# Altium schematic sheet 2017_IHM.SchDoc
size A2
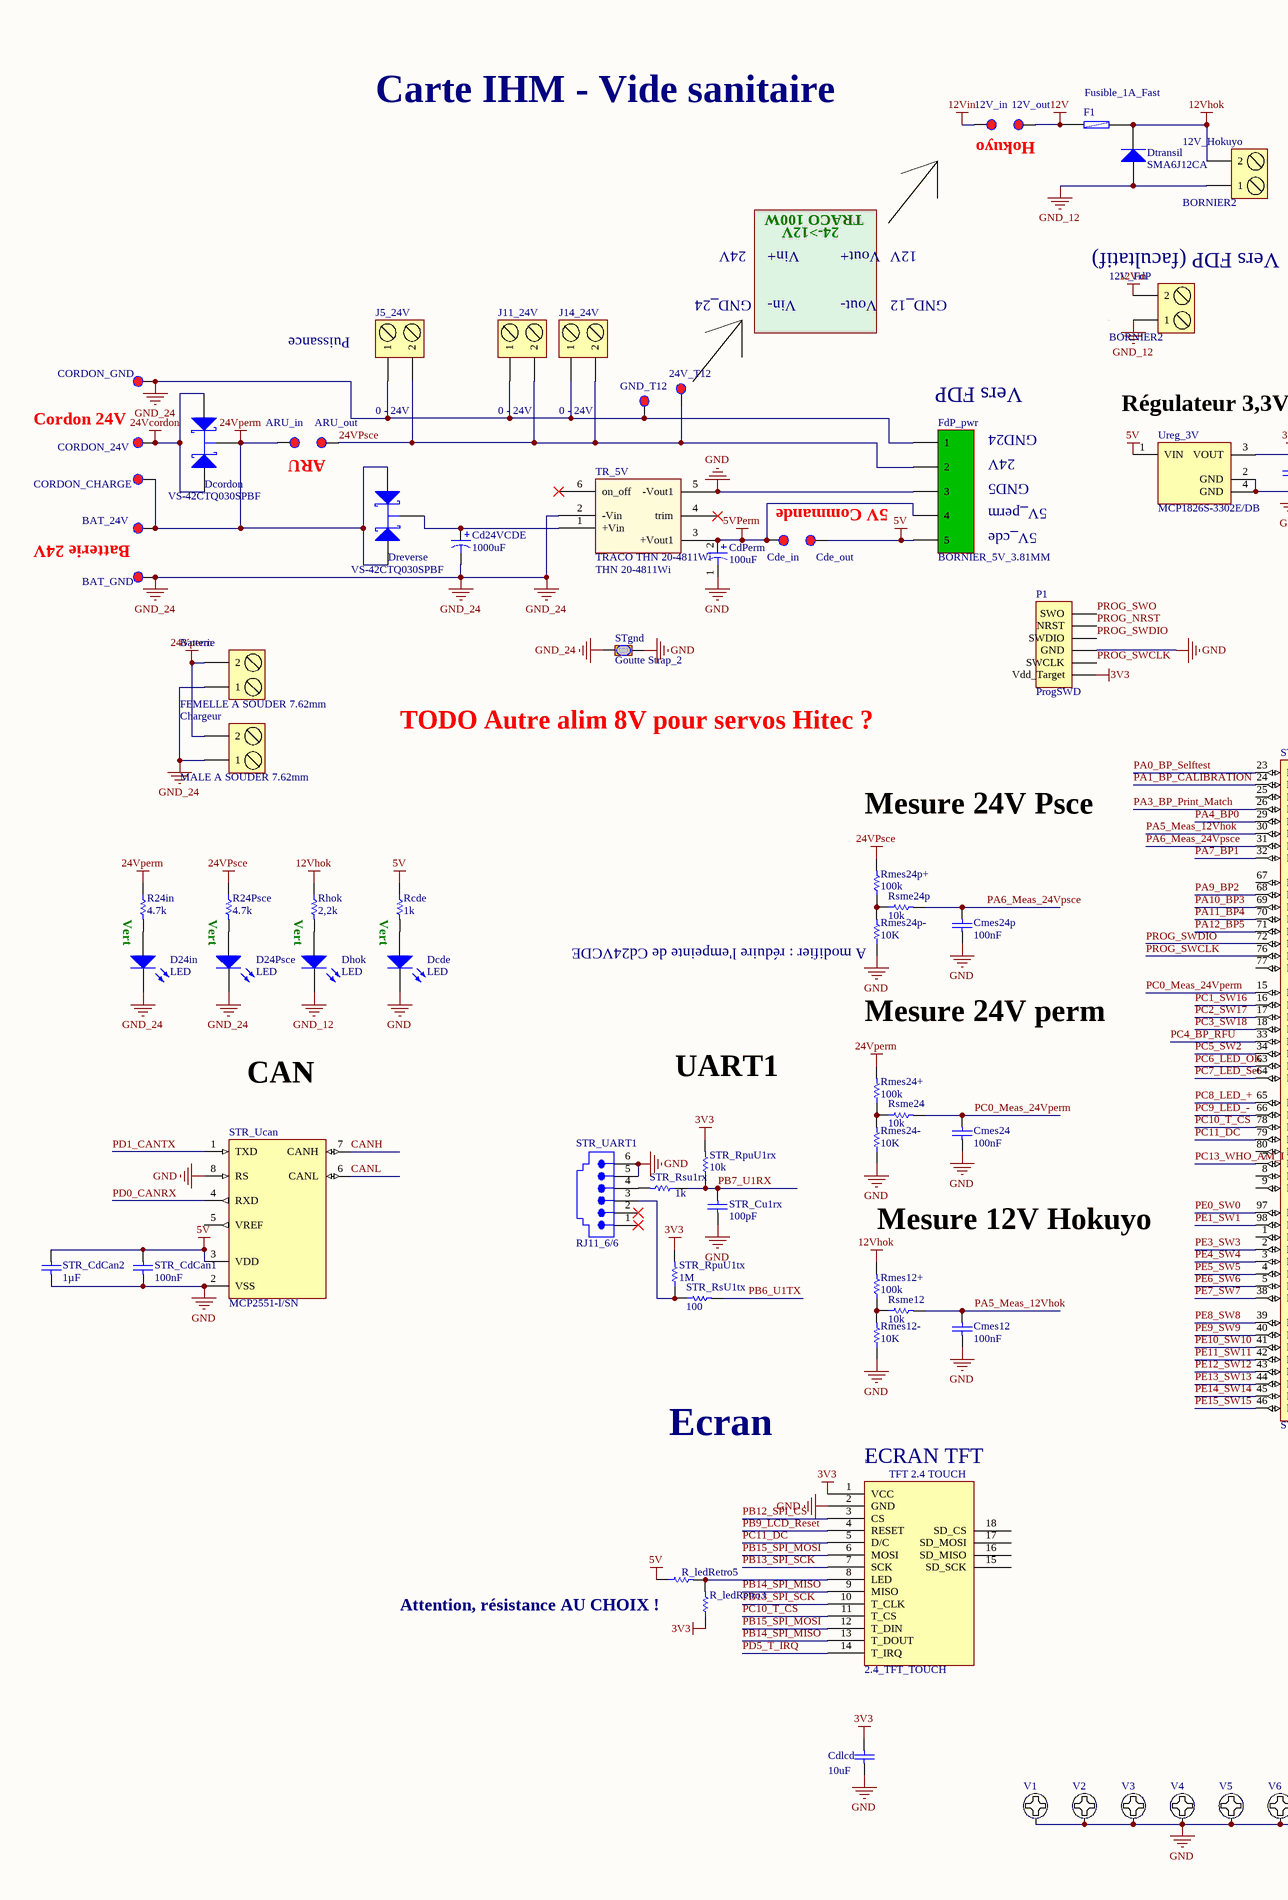
[diagram p0: 2017_IHM.SchDoc, left]
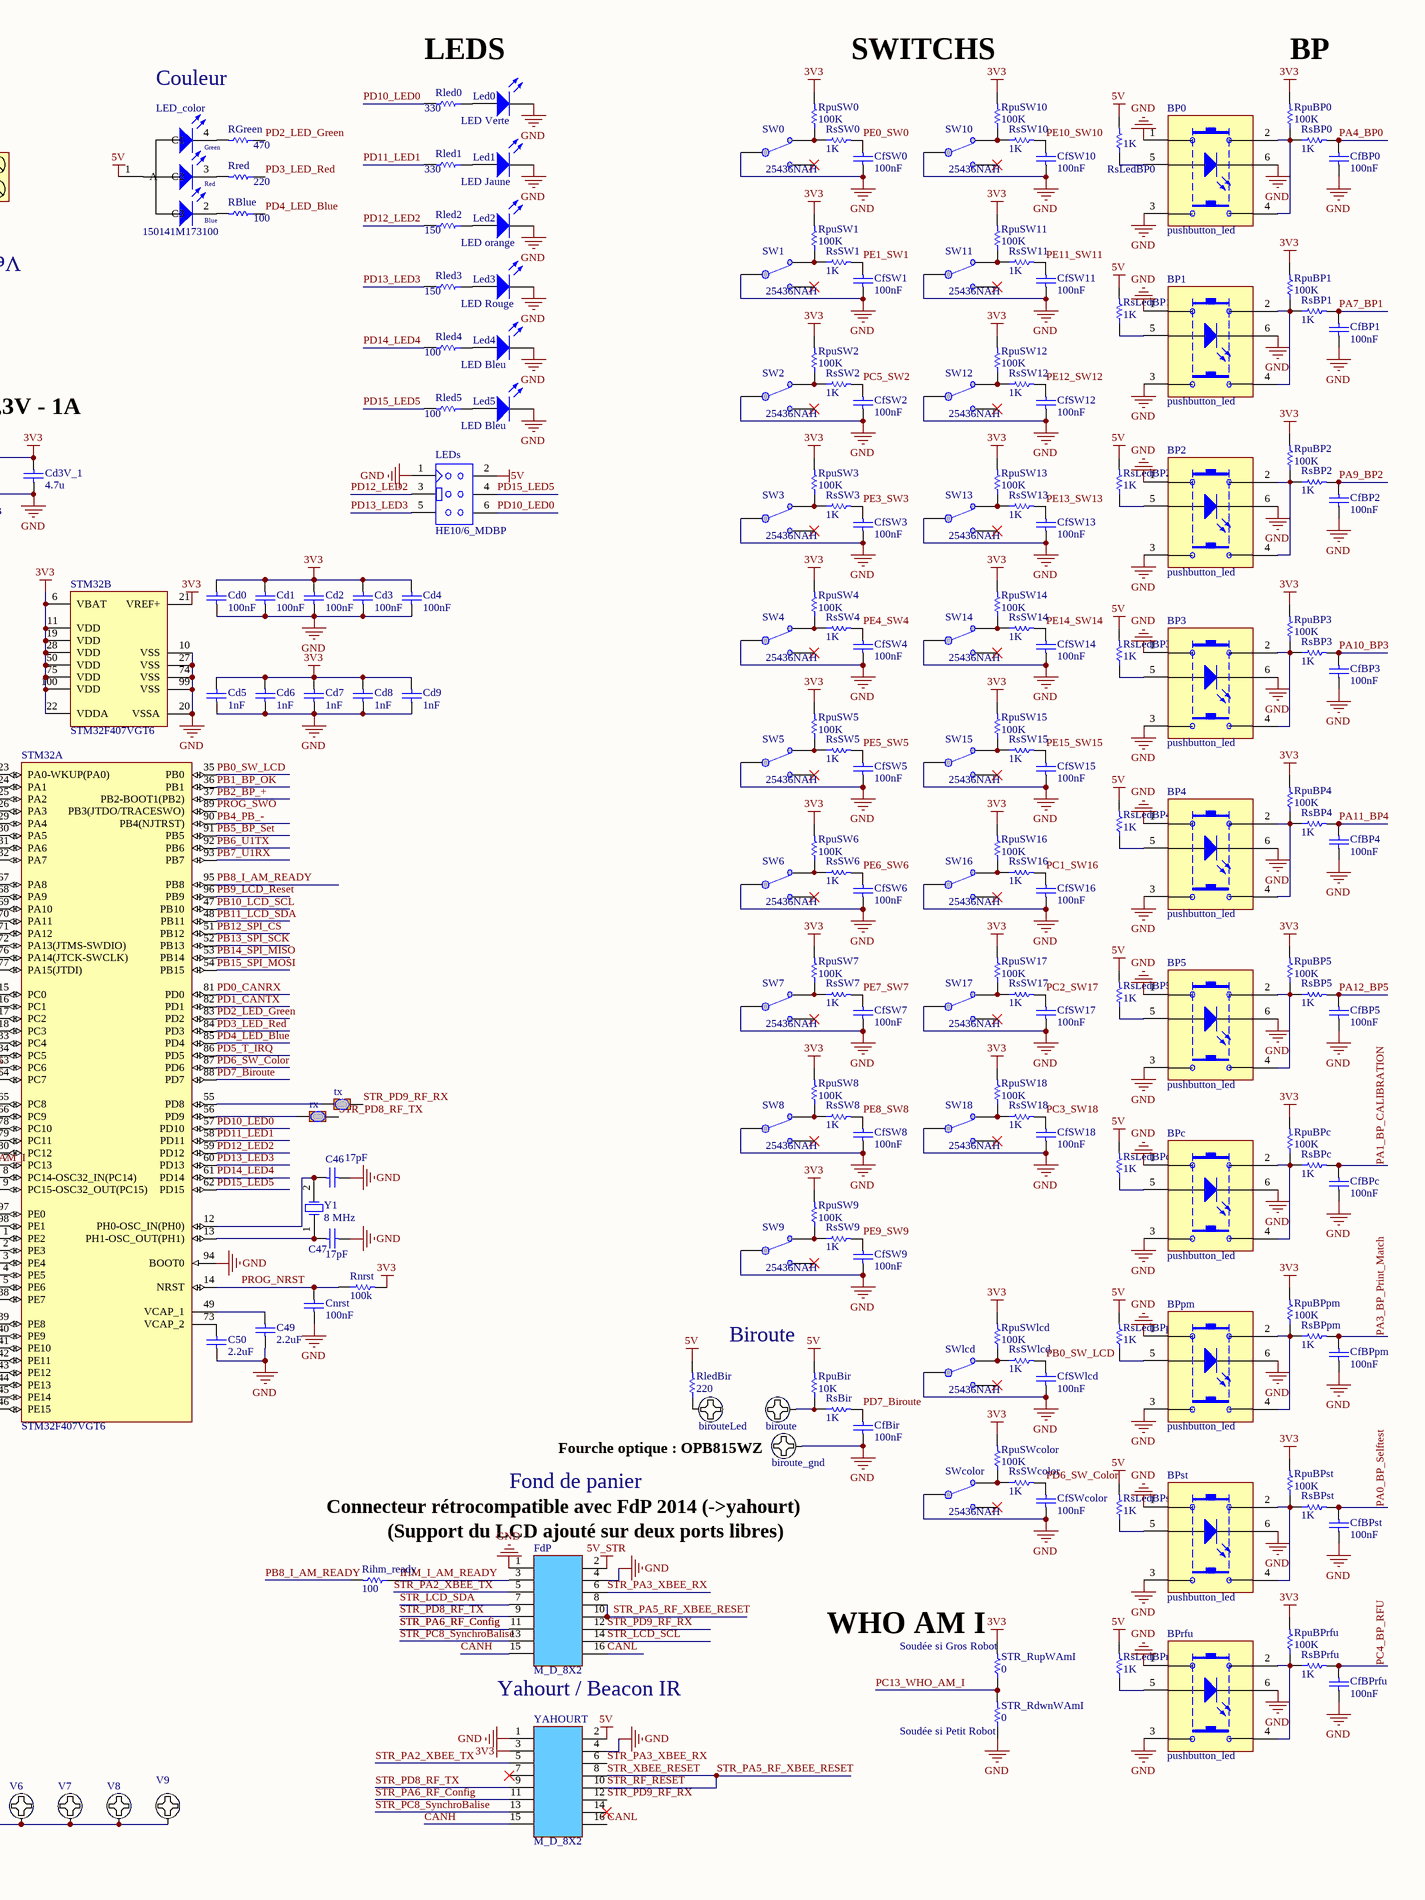
[diagram p1: 2017_IHM.SchDoc, right]

## Parts
12V_FdP  BORNIER2  [BORNIER2]
12V_Hokuyo  BORNIER2  [BORNIER2_HORIZ]
12V_in  Name  [Point Test_D3_P1.6mm]  (value not drawn)
12V_out  Name  [Point Test_D3_P1.6mm]  (value not drawn)
24V_T12  Name  [Point Test_D3_P1.6mm]  (value not drawn)
*  2.4_TFT_TOUCH  [2.4_TFT_TOUCH]
ARU_in  Name  [Point Test_D3_P1.6mm]  (value not drawn)
ARU_out  Name  [Point Test_D3_P1.6mm]  (value not drawn)
BAT_24V  Name  [Point Test_D3_P1.6mm]  (value not drawn)
BAT_GND  Name  [Point Test_D3_P1.6mm]  (value not drawn)
Batterie  FEMELLE A SOUDER 7.62mm  [BORNIER2_FEM_COUDE]
biroute  Pad_M3  [PAD_CMS_5.08x2.54]  (value not drawn)
biroute_gnd  Pad_M3  [PAD_CMS_5.08x2.54]  (value not drawn)
birouteLed  Pad_M3  [PAD_CMS_5.08x2.54]  (value not drawn)
BP0  pushbutton_led  [PUSHBUTTON_LED]
BP1  pushbutton_led  [PUSHBUTTON_LED]
BP2  pushbutton_led  [PUSHBUTTON_LED]
BP3  pushbutton_led  [PUSHBUTTON_LED]
BP4  pushbutton_led  [PUSHBUTTON_LED]
BP5  pushbutton_led  [PUSHBUTTON_LED]
BPc  pushbutton_led  [PUSHBUTTON_LED]
BPpm  pushbutton_led  [PUSHBUTTON_LED]
BPrfu  pushbutton_led  [PUSHBUTTON_LED]
BPst  pushbutton_led  [PUSHBUTTON_LED]
C46  17pF  [C0805_N]
C47  17pF  [C0805_N]
C49  2.2uF  [C0805_N]
C50  2.2uF  [C0805_N]
Cd0  100nF  [C0805_N]
Cd1  100nF  [C0805_N]
Cd2  100nF  [C0805_N]
Cd3  100nF  [C0805_N]
Cd3V_1  4.7u  [C0805_N]
Cd4  100nF  [C0805_N]
Cd5  1nF  [C0805_N]
Cd6  1nF  [C0805_N]
Cd7  1nF  [C0805_N]
Cd8  1nF  [C0805_N]
Cd9  1nF  [C0805_N]
Cd24VCDE  1000uF  [RESISTANCE_5W]
Cde_in  Name  [Point Test_D3_P1.6mm]  (value not drawn)
Cde_out  Name  [Point Test_D3_P1.6mm]  (value not drawn)
Cdlcd  10uF  [C0805_N]
CdPerm  100uF  [CONDENSATEUR_POLARISE_ELECTROLYTIQUE_RADIAL_5.08/8.9]
CfBir  100nF  [C0805_N]
CfBP0  100nF  [C0805_N]
CfBP1  100nF  [C0805_N]
CfBP2  100nF  [C0805_N]
CfBP3  100nF  [C0805_N]
CfBP4  100nF  [C0805_N]
CfBP5  100nF  [C0805_N]
CfBPc  100nF  [C0805_N]
CfBPpm  100nF  [C0805_N]
CfBPrfu  100nF  [C0805_N]
CfBPst  100nF  [C0805_N]
CfSW0  100nF  [C0805_N]
CfSW1  100nF  [C0805_N]
CfSW2  100nF  [C0805_N]
CfSW3  100nF  [C0805_N]
CfSW4  100nF  [C0805_N]
CfSW5  100nF  [C0805_N]
CfSW6  100nF  [C0805_N]
CfSW7  100nF  [C0805_N]
CfSW8  100nF  [C0805_N]
CfSW9  100nF  [C0805_N]
CfSW10  100nF  [C0805_N]
CfSW11  100nF  [C0805_N]
CfSW12  100nF  [C0805_N]
CfSW13  100nF  [C0805_N]
CfSW14  100nF  [C0805_N]
CfSW15  100nF  [C0805_N]
CfSW16  100nF  [C0805_N]
CfSW17  100nF  [C0805_N]
CfSW18  100nF  [C0805_N]
CfSWcolor  100nF  [C0805_N]
CfSWlcd  100nF  [C0805_N]
Chargeur  MALE A SOUDER 7.62mm  [BORNIER2_FEM_COUDE]
Cmes12  100nF  [C0805_N]
Cmes24  100nF  [C0805_N]
Cmes24p  100nF  [C0805_N]
Cnrst  100nF  [C0805_N]
CORDON_24V  Name  [Point Test_D3_P1.6mm]  (value not drawn)
CORDON_CHARGE  Name  [Point Test_D3_P1.6mm]  (value not drawn)
CORDON_GND  Name  [Point Test_D3_P1.6mm]  (value not drawn)
D24in  LED  [LED_0805]
D24Psce  LED  [LED_0805]
Dcde  LED  [LED_0805]
Dcordon  VS-42CTQ030SPBF  [D2Pak (123)]
Dhok  LED  [LED_0805]
Dreverse  VS-42CTQ030SPBF  [D2Pak (123)]
Dtransil  SMA6J12CA  [DO214AC]
F1  Fusible_1A_Fast  [R0805_N]
FdP  Type: M_D_8X2  [HE10/16_M_D_B P]  (hidden comment: BARRETTE_8 CONTACTS_2 RANGEES_MALE_DROITE)
FdP_pwr  BORNIER_5V_3.81MM  [BORNIER_5V_3.5MM_femelle_0]
GND_T12  Name  [Point Test_D3_P1.6mm]  (value not drawn)
J5_24V  0 - 24V  [BORNIER2_FEM_COUDE]
J11_24V  0 - 24V  [BORNIER2_FEM_COUDE]
J14_24V  0 - 24V  [BORNIER2_FEM_COUDE]
Led0  LED Verte  [LED_0805]
Led1  LED Jaune  [LED_0805]
Led2  LED orange  [LED_0805]
Led3  LED Rouge  [LED_0805]
Led4  LED Bleu  [LED_0805]
Led5  LED Bleu  [LED_0805]
LED_color  150141M173100  [3528]
LEDs  Type: HE10/6_MDBP  [HE10/6_M_D_BP]  (hidden comment: HE10/6_MALE_DROIT_BAS PROFIL)
P1  ProgSWD  [HDR1X6]
R24in  4.7k  [R1206_N]
R24Psce  4.7k  [R1206_N]
R_ledRetro3  (no value)  [R1206_N]
R_ledRetro5  (no value)  [R1206_N]
RBlue  100  [R1206_N]
Rcde  1k  [R1206_N]
RGreen  470  [R1206_N]
Rhok  2,2k  [R1206_N]
Rihm_ready  100  [R1206_N]
Rled0  330  [R1206_N]
Rled1  330  [R1206_N]
Rled2  150  [R1206_N]
Rled3  150  [R1206_N]
Rled4  100  [R1206_N]
Rled5  100  [R1206_N]
RledBir  220  [R1206_N]
Rmes12+  100k  [R1206_N]
Rmes12-  10K  [R1206_N]
Rmes24+  100k  [R1206_N]
Rmes24-  10K  [R1206_N]
Rmes24p+  100k  [R1206_N]
Rmes24p-  10K  [R1206_N]
Rnrst  100k  [R1206_N]
RpuBir  10K  [R1206_N]
RpuBP0  100K  [R1206_N]
RpuBP1  100K  [R1206_N]
RpuBP2  100K  [R1206_N]
RpuBP3  100K  [R1206_N]
RpuBP4  100K  [R1206_N]
RpuBP5  100K  [R1206_N]
RpuBPc  100K  [R1206_N]
RpuBPpm  100K  [R1206_N]
RpuBPrfu  100K  [R1206_N]
RpuBPst  100K  [R1206_N]
RpuSW0  100K  [R1206_N]
RpuSW1  100K  [R1206_N]
RpuSW2  100K  [R1206_N]
RpuSW3  100K  [R1206_N]
RpuSW4  100K  [R1206_N]
RpuSW5  100K  [R1206_N]
RpuSW6  100K  [R1206_N]
RpuSW7  100K  [R1206_N]
RpuSW8  100K  [R1206_N]
RpuSW9  100K  [R1206_N]
RpuSW10  100K  [R1206_N]
RpuSW11  100K  [R1206_N]
RpuSW12  100K  [R1206_N]
RpuSW13  100K  [R1206_N]
RpuSW14  100K  [R1206_N]
RpuSW15  100K  [R1206_N]
RpuSW16  100K  [R1206_N]
RpuSW17  100K  [R1206_N]
RpuSW18  100K  [R1206_N]
RpuSWcolor  100K  [R1206_N]
RpuSWlcd  100K  [R1206_N]
Rred  220  [R1206_N]
RsBir  1K  [R1206_N]
RsBP0  1K  [R1206_N]
RsBP1  1K  [R1206_N]
RsBP2  1K  [R1206_N]
RsBP3  1K  [R1206_N]
RsBP4  1K  [R1206_N]
RsBP5  1K  [R1206_N]
RsBPc  1K  [R1206_N]
RsBPpm  1K  [R1206_N]
RsBPrfu  1K  [R1206_N]
RsBPst  1K  [R1206_N]
RsLedBP0  1K  [R1206_N]
RsLedBP1  1K  [R1206_N]
RsLedBP2  1K  [R1206_N]
RsLedBP3  1K  [R1206_N]
RsLedBP4  1K  [R1206_N]
RsLedBP5  1K  [R1206_N]
RsLedBPc  1K  [R1206_N]
RsLedBPpm  1K  [R1206_N]
RsLedBPrfu  1K  [R1206_N]
RsLedBPst  1K  [R1206_N]
Rsme12  10k  [R1206_N]
Rsme24  10k  [R1206_N]
Rsme24p  10k  [R1206_N]
RsSW0  1K  [R1206_N]
RsSW1  1K  [R1206_N]
RsSW2  1K  [R1206_N]
RsSW3  1K  [R1206_N]
RsSW4  1K  [R1206_N]
RsSW5  1K  [R1206_N]
RsSW6  1K  [R1206_N]
RsSW7  1K  [R1206_N]
RsSW8  1K  [R1206_N]
RsSW9  1K  [R1206_N]
RsSW10  1K  [R1206_N]
RsSW11  1K  [R1206_N]
RsSW12  1K  [R1206_N]
RsSW13  1K  [R1206_N]
RsSW14  1K  [R1206_N]
RsSW15  1K  [R1206_N]
RsSW16  1K  [R1206_N]
RsSW17  1K  [R1206_N]
RsSW18  1K  [R1206_N]
RsSWcolor  1K  [R1206_N]
RsSWlcd  1K  [R1206_N]
rx  Goutte Strap_2  [Goutte Strap_2 Pads_Clearance 0.254mm]  (value not drawn)
STgnd  Goutte Strap_2  [Goutte Strap_2 Pads_Clearance 0.254mm]
STM32  STM32F407VGT6  [STM-LQFP100_N]  (parts A,B of 2)
STR_CdCan1  100nF  [C0805_N]
STR_CdCan2  1µF  [C0805_N]
STR_Cu1rx  100pF  [C0805_N]
STR_RdwnWAmI  0  [R1206_N]
STR_RpuU1rx  10k  [R1206_N]
STR_RpuU1tx  1M  [R1206_N]
STR_Rsu1rx  1k  [R1206_N]
STR_RsU1tx  100  [R1206_N]
STR_RupWAmI  0  [R1206_N]
STR_UART1  RJ11_6/6  [RJ11_6/6 - Wurth Half Shielded Tab Down WR-MJ]
STR_Ucan  MCP2551-I/SN  [SO8_N]
SW0  25436NAH  [SW_UNIPOL_DROIT - Ebay - SPDT - 11x6x5]
SW1  25436NAH  [SW_UNIPOL_DROIT - Ebay - SPDT - 11x6x5]
SW2  25436NAH  [SW_UNIPOL_DROIT - Ebay - SPDT - 11x6x5]
SW3  25436NAH  [SW_UNIPOL_DROIT - Ebay - SPDT - 11x6x5]
SW4  25436NAH  [SW_UNIPOL_DROIT - Ebay - SPDT - 11x6x5]
SW5  25436NAH  [SW_UNIPOL_DROIT - Ebay - SPDT - 11x6x5]
SW6  25436NAH  [SW_UNIPOL_DROIT - Ebay - SPDT - 11x6x5]
SW7  25436NAH  [SW_UNIPOL_DROIT - Ebay - SPDT - 11x6x5]
SW8  25436NAH  [SW_UNIPOL_DROIT - Ebay - SPDT - 11x6x5]
SW9  25436NAH  [SW_UNIPOL_DROIT - Ebay - SPDT - 11x6x5]
SW10  25436NAH  [SW_UNIPOL_DROIT - Ebay - SPDT - 11x6x5]
SW11  25436NAH  [SW_UNIPOL_DROIT - Ebay - SPDT - 11x6x5]
SW12  25436NAH  [SW_UNIPOL_DROIT - Ebay - SPDT - 11x6x5]
SW13  25436NAH  [SW_UNIPOL_DROIT - Ebay - SPDT - 11x6x5]
SW14  25436NAH  [SW_UNIPOL_DROIT - Ebay - SPDT - 11x6x5]
SW15  25436NAH  [SW_UNIPOL_DROIT - Ebay - SPDT - 11x6x5]
SW16  25436NAH  [SW_UNIPOL_DROIT - Ebay - SPDT - 11x6x5]
SW17  25436NAH  [SW_UNIPOL_DROIT - Ebay - SPDT - 11x6x5]
SW18  25436NAH  [SW_UNIPOL_DROIT - Ebay - SPDT - 11x6x5]
SWcolor  25436NAH  [SW_UNIPOL_DROIT - APEM 18235]
SWlcd  25436NAH  [SW_UNIPOL_DROIT - Ebay - SPDT - 11x6x5]
TR_5V  TRACO THN 20-4811Wi  Ref: THN 20-4811Wi  [TRACO_THN20]
tx  Goutte Strap_2  [Goutte Strap_2 Pads_Clearance 0.254mm]  (value not drawn)
Ureg_3V  MCP1826S-3302E/DB  [SOT223-4N]
V1  Pad_M3  [M3x6mm]  (value not drawn)
V2  Pad_M3  [M3x6mm]  (value not drawn)
V3  Pad_M3  [M3x6mm]  (value not drawn)
V4  Pad_M3  [M3x6mm]  (value not drawn)
V5  Pad_M3  [M3x6mm]  (value not drawn)
V6  Pad_M3  [M3x6mm]  (value not drawn)
V7  Pad_M3  [M3x6mm]  (value not drawn)
V8  Pad_M3  [M3x6mm]  (value not drawn)
V9  Pad_M3  [M3x6mm]  (value not drawn)
Y1  8 MHz  [HC49/4H_SMX]
YAHOURT  Type: M_D_8X2  [HE10/16_M_D_B P]  (hidden comment: BARRETTE_8 CONTACTS_2 RANGEES_MALE_DROITE)

## Nets
3V3: *.1(VCC) Cd0.2 Cd1.2 Cd2.2 Cd3.2 Cd3V_1.2 Cd4.2 Cd5.2 Cd6.2 Cd7.2 Cd8.2 Cd9.2 Cdlcd.1 P1.1(Vdd_Target) R_ledRetro3.1 Rnrst.2 RpuBP0.2 RpuBP1.2 RpuBP2.2 RpuBP3.2 RpuBP4.2 RpuBP5.2 RpuBPc.2 RpuBPpm.2 RpuBPrfu.2 RpuBPst.2 RpuSW0.2 RpuSW1.2 RpuSW2.2 RpuSW3.2 RpuSW4.2 RpuSW5.2 RpuSW6.2 RpuSW7.2 RpuSW8.2 RpuSW9.2 RpuSW10.2 RpuSW11.2 RpuSW12.2 RpuSW13.2 RpuSW14.2 RpuSW15.2 RpuSW16.2 RpuSW17.2 RpuSW18.2 RpuSWcolor.2 RpuSWlcd.2 STM32.6(VBAT) STM32.11(VDD) STM32.19(VDD) STM32.21(VREF+) STM32.22(VDDA) STM32.28(VDD) STM32.50(VDD) STM32.75(VDD) STM32.100(VDD) STR_RpuU1rx.2 STR_RpuU1tx.2 STR_RupWAmI.2 Ureg_3V.3(VOUT) YAHOURT.3
5V: Cde_out.1 FdP_pwr.5 LED_color.1(A) LEDs.2 R_ledRetro5.1 Rcde.1 RledBir.2 RpuBir.2 RsLedBP0.2 RsLedBP1.2 RsLedBP2.2 RsLedBP3.2 RsLedBP4.2 RsLedBP5.2 RsLedBPc.2 RsLedBPpm.2 RsLedBPrfu.2 RsLedBPst.2 STR_CdCan1.2 STR_CdCan2.2 STR_Ucan.3(VDD) Ureg_3V.1(VIN) YAHOURT.2
5V_STR: FdP.2
5VPerm: Cde_in.1 CdPerm.2 FdP_pwr.4 TR_5V.3(+Vout1)
12V: 12V_out.1 F1.1
12Vhok: 12V_Hokuyo.2 Dtransil.2(K) F1.2 Rhok.1 Rmes12+.2
12Vin: 12V_FdP.2 12V_in.1
24Vcordon: CORDON_24V.1 Dcordon.1(A1) Dcordon.3(A2)
24Vperm: ARU_in.1 BAT_24V.1 Batterie.2 Chargeur.2 CORDON_CHARGE.1 Dcordon.2(K) Dreverse.1(A1) Dreverse.3(A2) R24in.1 Rmes24+.2
24VPsce: 24V_T12.1 ARU_out.1 FdP_pwr.2 J5_24V.2 J11_24V.2 J14_24V.2 R24Psce.1 Rmes24p+.2
GND: *.2(GND) biroute_gnd.1 BP0.1 BP0.3 BP0.6(-) BP1.1 BP1.3 BP1.6(-) BP2.1 BP2.3 BP2.6(-) BP3.1 BP3.3 BP3.6(-) BP4.1 BP4.3 BP4.6(-) BP5.1 BP5.3 BP5.6(-) BPc.1 BPc.3 BPc.6(-) BPpm.1 BPpm.3 BPpm.6(-) BPrfu.1 BPrfu.3 BPrfu.6(-) BPst.1 BPst.3 BPst.6(-) C46.1 C47.1 C49.1 C50.1 Cd0.1 Cd1.1 Cd2.1 Cd3.1 Cd3V_1.1 Cd4.1 Cd5.1 Cd6.1 Cd7.1 Cd8.1 Cd9.1 Cdlcd.2 CdPerm.1 CfBir.1 CfBP0.1 CfBP1.1 CfBP2.1 CfBP3.1 CfBP4.1 CfBP5.1 CfBPc.1 CfBPpm.1 CfBPrfu.1 CfBPst.1 CfSW0.1 CfSW1.1 CfSW2.1 CfSW3.1 CfSW4.1 CfSW5.1 CfSW6.1 CfSW7.1 CfSW8.1 CfSW9.1 CfSW10.1 CfSW11.1 CfSW12.1 CfSW13.1 CfSW14.1 CfSW15.1 CfSW16.1 CfSW17.1 CfSW18.1 CfSWcolor.1 CfSWlcd.1 Cmes12.1 Cmes24.1 Cmes24p.1 Cnrst.1 Dcde.2(K) FdP.1 FdP.4 FdP_pwr.3 Led0.2(K) Led1.2(K) Led2.2(K) Led3.2(K) Led4.2(K) Led5.2(K) LEDs.1 P1.3(GND) Rmes12-.1 Rmes24-.1 Rmes24p-.1 STgnd.2 STM32.10(VSS) STM32.20(VSSA) STM32.27(VSS) STM32.74(VSS) STM32.94(BOOT0) STM32.99(VSS) STR_CdCan1.1 STR_CdCan2.1 STR_Cu1rx.1 STR_RdwnWAmI.1 STR_UART1.5 STR_UART1.6 STR_Ucan.2(VSS) STR_Ucan.8(RS) SW0.COMMON1 SW1.COMMON1 SW2.COMMON1 SW3.COMMON1 SW4.COMMON1 SW5.COMMON1 SW6.COMMON1 SW7.COMMON1 SW8.COMMON1 SW9.COMMON1 SW10.COMMON1 SW11.COMMON1 SW12.COMMON1 SW13.COMMON1 SW14.COMMON1 SW15.COMMON1 SW16.COMMON1 SW17.COMMON1 SW18.COMMON1 SWcolor.COMMON1 SWlcd.COMMON1 TR_5V.5(-Vout1) Ureg_3V.2(GND) Ureg_3V.4(GND) V1.1 V2.1 V3.1 V4.1 V5.1 V6.1 V7.1 V8.1 V9.1 YAHOURT.1 YAHOURT.4
GND_12: 12V_FdP.1 12V_Hokuyo.1 Dhok.2(K) Dtransil.1(A)
GND_24: BAT_GND.1 Batterie.1 Cd24VCDE.1 Chargeur.1 CORDON_GND.1 D24in.2(K) D24Psce.2(K) FdP_pwr.1 GND_T12.1 J5_24V.1 J11_24V.1 J14_24V.1 STgnd.1 TR_5V.2(-Vin)
CANH: FdP.15 STR_Ucan.7(CANH) YAHOURT.15
CANL: FdP.16 STR_Ucan.6(CANL) YAHOURT.16
IHM_I_AM_READY: FdP.3 Rihm_ready.1
PA0_BP_Selftest: CfBPst.2 RsBPst.2 STM32.23(PA0-WKUP(PA0))
PA1_BP_CALIBRATION: CfBPc.2 RsBPc.2 STM32.24(PA1)
PA3_BP_Print_Match: CfBPpm.2 RsBPpm.2 STM32.26(PA3)
PA4_BP0: CfBP0.2 RsBP0.2 STM32.29(PA4)
PA5_Meas_12Vhok: Cmes12.2 Rsme12.2 STM32.30(PA5)
PA6_Meas_24Vpsce: Cmes24p.2 Rsme24p.2 STM32.31(PA6)
PA7_BP1: CfBP1.2 RsBP1.2 STM32.32(PA7)
PA9_BP2: CfBP2.2 RsBP2.2 STM32.68(PA9)
PA10_BP3: CfBP3.2 RsBP3.2 STM32.69(PA10)
PA11_BP4: CfBP4.2 RsBP4.2 STM32.70(PA11)
PA12_BP5: CfBP5.2 RsBP5.2 STM32.71(PA12)
PB0_SW_LCD: CfSWlcd.2 RsSWlcd.2 STM32.35(PB0)
PB1_BP_OK: STM32.36(PB1)
PB2_BP_+: STM32.37(PB2-BOOT1(PB2))
PB4_PB_-: STM32.90(PB4(NJTRST))
PB5_BP_Set: STM32.91(PB5)
PB6_U1TX: STM32.92(PB6) STR_RsU1tx.2
PB7_U1RX: STM32.93(PB7) STR_Cu1rx.2 STR_RpuU1rx.1 STR_Rsu1rx.1
PB8_I_AM_READY: Rihm_ready.2 STM32.95(PB8)
PB9_LCD_Reset: *.4(RESET) STM32.96(PB9)
PB10_LCD_SCL: STM32.47(PB10)
PB11_LCD_SDA: STM32.48(PB11)
PB12_SPI_CS: *.3(CS) STM32.51(PB12)
PB13_SPI_SCK: *.7(SCK) *.10(T_CLK) STM32.52(PB13)
PB14_SPI_MISO: *.9(MISO) *.13(T_DOUT) STM32.53(PB14)
PB15_SPI_MOSI: *.6(MOSI) *.12(T_DIN) STM32.54(PB15)
PC0_Meas_24Vperm: Cmes24.2 Rsme24.2 STM32.15(PC0)
PC1_SW16: CfSW16.2 RsSW16.2 STM32.16(PC1)
PC2_SW17: CfSW17.2 RsSW17.2 STM32.17(PC2)
PC3_SW18: CfSW18.2 RsSW18.2 STM32.18(PC3)
PC4_BP_RFU: CfBPrfu.2 RsBPrfu.2 STM32.33(PC4)
PC5_SW2: CfSW2.2 RsSW2.2 STM32.34(PC5)
PC6_LED_OK: STM32.63(PC6)
PC7_LED_Set: STM32.64(PC7)
PC8_LED_+: STM32.65(PC8)
PC9_LED_-: STM32.66(PC9)
PC10_T_CS: *.11(T_CS) STM32.78(PC10)
PC11_DC: *.5(D/C) STM32.79(PC11)
PC13_WHO_AM_I: STM32.7(PC13) STR_RdwnWAmI.2 STR_RupWAmI.1
PD0_CANRX: STM32.81(PD0) STR_Ucan.4(RXD)
PD1_CANTX: STM32.82(PD1) STR_Ucan.1(TXD)
PD2_LED_Green: RGreen.1 STM32.83(PD2)
PD3_LED_Red: Rred.1 STM32.84(PD3)
PD4_LED_Blue: RBlue.1 STM32.85(PD4)
PD5_T_IRQ: *.14(T_IRQ) STM32.86(PD5)
PD6_SW_Color: CfSWcolor.2 RsSWcolor.2 STM32.87(PD6)
PD7_Biroute: CfBir.2 RsBir.2 STM32.88(PD7)
PD10_LED0: LEDs.6 Rled0.2 STM32.57(PD10)
PD11_LED1: Rled1.2 STM32.58(PD11)
PD12_LED2: LEDs.3 Rled2.2 STM32.59(PD12)
PD13_LED3: LEDs.5 Rled3.2 STM32.60(PD13)
PD14_LED4: Rled4.2 STM32.61(PD14)
PD15_LED5: LEDs.4 Rled5.2 STM32.62(PD15)
PE0_SW0: CfSW0.2 RsSW0.2 STM32.97(PE0)
PE1_SW1: CfSW1.2 RsSW1.2 STM32.98(PE1)
PE3_SW3: CfSW3.2 RsSW3.2 STM32.2(PE3)
PE4_SW4: CfSW4.2 RsSW4.2 STM32.3(PE4)
PE5_SW5: CfSW5.2 RsSW5.2 STM32.4(PE5)
PE6_SW6: CfSW6.2 RsSW6.2 STM32.5(PE6)
PE7_SW7: CfSW7.2 RsSW7.2 STM32.38(PE7)
PE8_SW8: CfSW8.2 RsSW8.2 STM32.39(PE8)
PE9_SW9: CfSW9.2 RsSW9.2 STM32.40(PE9)
PE10_SW10: CfSW10.2 RsSW10.2 STM32.41(PE10)
PE11_SW11: CfSW11.2 RsSW11.2 STM32.42(PE11)
PE12_SW12: CfSW12.2 RsSW12.2 STM32.43(PE12)
PE13_SW13: CfSW13.2 RsSW13.2 STM32.44(PE13)
PE14_SW14: CfSW14.2 RsSW14.2 STM32.45(PE14)
PE15_SW15: CfSW15.2 RsSW15.2 STM32.46(PE15)
PROG_NRST: Cnrst.2 P1.5(NRST) Rnrst.1 STM32.14(NRST)
PROG_SWCLK: P1.2(SWCLK) STM32.76(PA14(JTCK-SWCLK))
PROG_SWDIO: P1.4(SWDIO) STM32.72(PA13(JTMS-SWDIO))
PROG_SWO: P1.6(SWO) STM32.89(PB3(JTDO/TRACESWO))
STR_LCD_SCL: FdP.14
STR_LCD_SDA: FdP.7
STR_PA2_XBEE_TX: FdP.5 YAHOURT.5
STR_PA3_XBEE_RX: FdP.6 YAHOURT.6
STR_PA5_RF_XBEE_RESET: FdP.8 FdP.10 YAHOURT.8 YAHOURT.10  [also labelled STR_RF_RESET, STR_XBEE_RESET]
STR_PA6_RF_Config: FdP.11 YAHOURT.11
STR_PC8_SynchroBalise: FdP.13 YAHOURT.13
STR_PD8_RF_TX: FdP.9 rx.2 YAHOURT.9
STR_PD9_RF_RX: FdP.12 tx.2 YAHOURT.12
Net*_8: *.8(LED) R_ledRetro3.2 R_ledRetro5.2
Netbiroute_1: biroute.1 RpuBir.1 RsBir.1
NetbirouteLed_1: birouteLed.1 RledBir.1
NetBP0_2: BP0.2 BP0.4 RpuBP0.1 RsBP0.1
NetBP0_5: BP0.5(+) RsLedBP0.1
NetBP1_2: BP1.2 BP1.4 RpuBP1.1 RsBP1.1
NetBP1_5: BP1.5(+) RsLedBP1.1
NetBP2_2: BP2.2 BP2.4 RpuBP2.1 RsBP2.1
NetBP2_5: BP2.5(+) RsLedBP2.1
NetBP3_2: BP3.2 BP3.4 RpuBP3.1 RsBP3.1
NetBP3_5: BP3.5(+) RsLedBP3.1
NetBP4_2: BP4.2 BP4.4 RpuBP4.1 RsBP4.1
NetBP4_5: BP4.5(+) RsLedBP4.1
NetBP5_2: BP5.2 BP5.4 RpuBP5.1 RsBP5.1
NetBP5_5: BP5.5(+) RsLedBP5.1
NetBPc_2: BPc.2 BPc.4 RpuBPc.1 RsBPc.1
NetBPc_5: BPc.5(+) RsLedBPc.1
NetBPpm_2: BPpm.2 BPpm.4 RpuBPpm.1 RsBPpm.1
NetBPpm_5: BPpm.5(+) RsLedBPpm.1
NetBPrfu_2: BPrfu.2 BPrfu.4 RpuBPrfu.1 RsBPrfu.1
NetBPrfu_5: BPrfu.5(+) RsLedBPrfu.1
NetBPst_2: BPst.2 BPst.4 RpuBPst.1 RsBPst.1
NetBPst_5: BPst.5(+) RsLedBPst.1
NetC46_2: C46.2 STM32.12(PH0-OSC_IN(PH0)) Y1.2(OSC2)
NetC47_2: C47.2 STM32.13(PH1-OSC_OUT(PH1)) Y1.1(OSC1)
NetC49_2: C49.2 STM32.49(VCAP_1)
NetC50_2: C50.2 STM32.73(VCAP_2)
NetCd24VCDE_2: Cd24VCDE.2 Dreverse.2(K) TR_5V.1(+Vin)
NetD24in_1: D24in.1(A) R24in.2
NetD24Psce_1: D24Psce.1(A) R24Psce.2
NetDcde_1: Dcde.1(A) Rcde.2
NetDhok_1: Dhok.1(A) Rhok.2
NetLed0_1: Led0.1(A) Rled0.1
NetLed1_1: Led1.1(A) Rled1.1
NetLed2_1: Led2.1(A) Rled2.1
NetLed3_1: Led3.1(A) Rled3.1
NetLed4_1: Led4.1(A) Rled4.1
NetLed5_1: Led5.1(A) Rled5.1
NetLED_color_2: LED_color.2(C3) RBlue.2
NetLED_color_3: LED_color.3(C2) Rred.2
NetLED_color_4: LED_color.4(C1) RGreen.2
NetRmes12+_1: Rmes12+.1 Rmes12-.2 Rsme12.1
NetRmes24+_1: Rmes24+.1 Rmes24-.2 Rsme24.1
NetRmes24p+_1: Rmes24p+.1 Rmes24p-.2 Rsme24p.1
NetRpuSW0_1: RpuSW0.1 RsSW0.1 SW0.NC1
NetRpuSW1_1: RpuSW1.1 RsSW1.1 SW1.NC1
NetRpuSW2_1: RpuSW2.1 RsSW2.1 SW2.NC1
NetRpuSW3_1: RpuSW3.1 RsSW3.1 SW3.NC1
NetRpuSW4_1: RpuSW4.1 RsSW4.1 SW4.NC1
NetRpuSW5_1: RpuSW5.1 RsSW5.1 SW5.NC1
NetRpuSW6_1: RpuSW6.1 RsSW6.1 SW6.NC1
NetRpuSW7_1: RpuSW7.1 RsSW7.1 SW7.NC1
NetRpuSW8_1: RpuSW8.1 RsSW8.1 SW8.NC1
NetRpuSW9_1: RpuSW9.1 RsSW9.1 SW9.NC1
NetRpuSW10_1: RpuSW10.1 RsSW10.1 SW10.NC1
NetRpuSW11_1: RpuSW11.1 RsSW11.1 SW11.NC1
NetRpuSW12_1: RpuSW12.1 RsSW12.1 SW12.NC1
NetRpuSW13_1: RpuSW13.1 RsSW13.1 SW13.NC1
NetRpuSW14_1: RpuSW14.1 RsSW14.1 SW14.NC1
NetRpuSW15_1: RpuSW15.1 RsSW15.1 SW15.NC1
NetRpuSW16_1: RpuSW16.1 RsSW16.1 SW16.NC1
NetRpuSW17_1: RpuSW17.1 RsSW17.1 SW17.NC1
NetRpuSW18_1: RpuSW18.1 RsSW18.1 SW18.NC1
NetRpuSWcolor_1: RpuSWcolor.1 RsSWcolor.1 SWcolor.NC1
NetRpuSWlcd_1: RpuSWlcd.1 RsSWlcd.1 SWlcd.NC1
Netrx_1: rx.1 STM32.56(PD9)
NetSTM32_55: STM32.55(PD8) tx.1
NetSTR_RpuU1tx_1: STR_RpuU1tx.1 STR_RsU1tx.1 STR_UART1.3
NetSTR_Rsu1rx_2: STR_Rsu1rx.2 STR_UART1.4

Not connected (* = marked no-connect by the designer): * 15(SD_SCK) 16(SD_MISO) 17(SD_MOSI) 18(SD_CS); STM32 1(PE2) 8(PC14-OSC32_IN(PC14)) 9(PC15-OSC32_OUT(PC15)) 25(PA2) 67(PA8) 77(PA15(JTDI)) 80(PC12); STR_UART1 1* 2*; STR_Ucan 5(VREF); SW0 NO1*; SW1 NO1*; SW2 NO1*; SW3 NO1*; SW4 NO1*; SW5 NO1*; SW6 NO1*; SW7 NO1*; SW8 NO1*; SW9 NO1*; SW10 NO1*; SW11 NO1*; SW12 NO1*; SW13 NO1*; SW14 NO1*; SW15 NO1*; SW16 NO1*; SW17 NO1*; SW18 NO1*; SWcolor NO1*; SWlcd NO1*; TR_5V 4(trim)* 6(on_off)*; YAHOURT 7* 14*

## Notes on the sheet
- Couleur
- LEDS
- SWITCHS
- (near RpuBP0) BP
- Carte IHM - Vide sanitaire
- Hokuyo
- TRACO 100W
- 24V
- Vin+
- 24->12V
- Vout+
- 12V
- (near 12V_FdP) Vers FDP (facultatif)
- (near J5_24V) Puissance
- GND_24
- Vin-
- Vout-
- GND_12
- (near FdP_pwr) Vers FDP
- Cordon 24V
- ARU
- GND24
- Régulateur 3,3V - 1A
- 5V Commande
- 5V_perm
- GND5
- Batterie 24V
- 5V_cde
- TODO Autre alim 8V pour servos Hitec ?
- Mesure 24V Psce
- Vert
- (near Rmes24p-) A modifier : réduire l'empeinte de Cd24VCDE
- Mesure 24V perm
- CAN
- UART1
- Mesure 12V Hokuyo
- (near RpuBir) Biroute
- Ecran
- (near *) ECRAN TFT
- Fond de panier
- Fourche optique : OPB815WZ
- Connecteur rétrocompatible avec FdP 2014 (->yahourt)
- (Support du LCD ajouté sur deux ports libres)
- Attention, résistance AU CHOIX !
- WHO AM I
- (near STR_RupWAmI) Soudée si Gros Robot
- Yahourt / Beacon IR
- (near STR_RdwnWAmI) Soudée si Petit Robot
- Title
- Size:
- Date:
- File:
- A2
- Number:
- Time:
- Revision:
- Sheet
- of
- (in symbol 2.4_TFT_TOUCH) TFT 2.4 TOUCH
- (in symbol WL-SFTW 3528 150141M173100) Green; Red; Blue

## Library data of the parts
12V_FdP 12V_Hokuyo Batterie Chargeur J5_24V J11_24V J14_24V = BORNIER2: Terminal blocks, 2 pins, pitch=5mm
12V_in 12V_out 24V_T12 ARU_in ARU_out BAT_24V BAT_GND Cde_in Cde_out CORDON_24V CORDON_CHARGE CORDON_GND GND_T12 = Point Test: Publisher: Damien GUITTON
biroute biroute_gnd birouteLed V1-V9 = Vis M3 X 6mm _TORX_Tête 6mm: Publisher: Damien Guitton
C46 C47 C49 C50 Cd0-Cd9 Cdlcd CfBir CfBP0-CfBP5 CfBPc CfBPpm CfBPrfu CfBPst CfSW0-CfSW18 CfSWcolor CfSWlcd Cmes12 Cmes24 Cmes24p Cnrst STR_CdCan1 STR_CdCan2 STR_Cu1rx = Condensateur: Capacitor; Published: 8-Jun-2000; LatestRevisionDate: 17-Jul-2002; LatestRevisionNote: Re-released for DXP Platform.; PackageReference: RAD-0.3; Publisher: Altium Limited
Cd3V_1 = Capacitor: Published: 8-Jun-2000; LatestRevisionDate: 17-Jul-2002; LatestRevisionNote: Re-released for DXP Platform.; PackageReference: RAD-0.3; Publisher: Altium Limited
Cd24VCDE CdPerm = Condensateur Polarise Traversant: Polarized Capacitor
D24in D24Psce Dcde Dhok Led0-Led5 = LED: Typical LED; Published: 8-Jun-2000; LatestRevisionDate: 08-Jul-2005; LatestRevisionNote: Mech Layer 1 removed.; PackageReference: LED-1; Publisher: Altium Limited
Dcordon Dreverse = Diode Shottky double BAT54C: DIODE SCHOTTKY DOUBLE; Manufacturer Part Number: BAT54C; Manufacturer: ZETEX; Diode Case Style: SOT-23; Supplier Part Number: 9526501; Supplier: Farnell; ComponentLink1URL: http://www.farnell.com/datasheets/27632.pdf; ComponentLink1Description: http://www.farnell.com/datasheets/27632.pdf; Pricing: 5=0,32, 25=0,23, 100=0,198, 1000=0,154 (EUR); RoHS: YES
Dtransil = Diode 1N4001: 1 Amp General Purpose Rectifier; Published: 8-Jun-2000; LatestRevisionDate: 17-Jul-2002; LatestRevisionNote: Re-released for DXP Platform.; DatasheetVersion: 1998; PackageVersion: Aug-1999; PackageReference: DO-41; Publisher: Altium Limited; Code_JEDEC: DO-204-AL; ComponentLink1Description: Manufacturer Link; ComponentLink1URL: http://www.fairchildsemi.com/; ComponentLink2Description: Datasheet; ComponentLink2URL: http://www.fairchildsemi.com/ds/1N%2F1N4001.pdf
F1 = Fusible_SMD: Fuse; Published: 8-Jun-2000; LatestRevisionDate: 17-Jul-2002; LatestRevisionNote: Re-released for DXP Platform.; PackageReference: PIN-W2/E2.8; Publisher: Altium Limited
LED_color = WL-SFTW 3528 150141M173100: SMD Full-Color Top LED, WL-SFTW, Red & Green & Blue; Manufacturer: Würth Elektronik eiSos GmbH; PartNo: 150141M173100; ComponentLink1Description: Manufacturer; ComponentLink1URL: http://www.we-online.de; Created by: Christin Otto; Created Date: June 2013; ComponentLink2Description: Datasheet; ComponentLink2URL: http://katalog.we-online.com/led/datasheet/150141M173100.pdf; Color: Red & Green & Blue
LEDs = HE10/6_MALE_DROIT_BAS PROFIL: EMBASE HE10/6 MALE DROIT BAS PROFIL
P1 = Header 6: Header, 6-Pin; LatestRevisionDate: 17-Jul-2002; LatestRevisionNote: Re-released for DXP Platform.; Publisher: Altium Limited
R24in R24Psce R_ledRetro3 R_ledRetro5 RBlue Rcde RGreen Rhok Rihm_ready Rled0-Rled5 RledBir Rmes12+ Rmes12- Rmes24+ Rmes24- Rmes24p+ Rmes24p- Rnrst RpuBir RpuBP0-RpuBP5 RpuBPc RpuBPpm RpuBPrfu RpuBPst RpuSW0-RpuSW18 RpuSWcolor RpuSWlcd Rred RsBir RsBP0-RsBP5 RsBPc RsBPpm RsBPrfu RsBPst RsLedBP0-RsLedBP5 RsLedBPc RsLedBPpm RsLedBPrfu RsLedBPst Rsme12 Rsme24 Rsme24p RsSW0-RsSW18 RsSWcolor RsSWlcd STR_RdwnWAmI STR_RpuU1rx STR_RpuU1tx STR_Rsu1rx STR_RsU1tx STR_RupWAmI = Resistor: Published: 8-Jun-2000; LatestRevisionDate: 17-Jul-2002; LatestRevisionNote: Re-released for DXP Platform.; PackageReference: AXIAL-0.5; Publisher: Altium Limited
STM32 = STM32F407VGT6: ARM Cortex-M4 32-bit MCU+FPU, 210 DMIPS, 1024 kB Flash, 192 kB Internal RAM, 82 I/Os, 100-pin LQFP, -40 to 85 degC, Tray; Manufacturer: STMicroelectronics; D/A Converter: 2x12-bit; FLASH Size (Prog) (kB): 1024; I/Os (High Current): 82; Internal RAM Size (kB): 192; Operating Frequency(F) (Processor speed) (MHz): 168; Supply Voltage(Vcc) max (V): 3.6; Supply Voltage(Vcc) min (V): 1.8; DatasheetVersion: Rev. 4; PackageVersion: Rev. 1, 06/2013; PackageReference: LQFP100; PackageDescription: 100-Pin Low Profile Quad Flat Package, 14 x 14 mm Body, 0.5 mm Pitch; Supplier 1: Digi-Key; Supplier Part Number 1: 497-11605-ND; Supplier 2: Farnell; Supplier Part Number 2: 2064368; Supplier 3: Newark; Supplier Part Number 3: 73T2333; Supplier 4: Mouser; Supplier Part Number 4: 511-STM32F407VGT6; Core: ARM Cortex-M4; Packing: Tray; Mounting Technology: Surface Mount; PartNumber: STM32F407VGT6; ComponentLink1Description: Manufacturer URL; ComponentLink1URL: http://www.st.com/web/en/home.html; ComponentLink2Description: Datasheet; ComponentLink2URL: http://www.st.com/st-web-ui/static/active/en/resource/technical/document/datasheet/DM00037051.pdf; ComponentLink3Description: Package Specification; ComponentLink3URL: http://www.st.com/st-web-ui/static/active/en/resource/technical/document/data_brief/DM00071938.pdf
STR_UART1 = RJ11_6/6: Right Angle, Standard Profile, Offset Latch DECconnect, Flangeless PCB Jack; Ports: 1; Positions/Loaded: Port1 - 6 Offset Latch/6; PerformanceCategory: 3; PCB_Mounting: Thru-Hole; DrillSize: Nominal, Rounded to nearest 0.05mm; PCB_Layout: Complies with Manufacturer's Recommendation.; Published: 25-Jun-2002; DatasheetDocument: 18-Dec-2001; PackageDocument: 18-Dec-2001; PackageReference: 15-43-6110; Publisher: Altium Limited; ComponentLink1Description: Manufacturer Link; ComponentLink1URL: http://www.molex.com/; ComponentLink2Description: Datasheet; ComponentLink2URL: http://www.molex.com/cmc_upload/common_files/1212003_41369catalogpage.pdf; Type: RJ11_6/6
STR_Ucan = MCP2551-I/SN: High-Speed CAN Transceiver, 8-Pin SOIC, Industrial Temperature; Published: 25/11/09; DatasheetVersion: revE, Jan-2007; PackageVersion: revAW, Oct-2008; PackageReference: SOIC-SN8; Publisher: Damien Guitton; PackageDescription: 8-Lead Plastic Small Outline (SN) - Narrow, 3.90mm Body [SOIC]; Code_JEDEC: MS-012; Code_IPC: SOIC127P600-8; ComponentLink1Description: Manufacturer Link; ComponentLink1URL: http://www.microchip.com; ComponentLink2Description: Datasheet; ComponentLink2URL: http://ww1.microchip.com/downloads/en/DeviceDoc/21667E.pdf; ComponentLink3Description: Packaging Specification; ComponentLink3URL: http://ww1.microchip.com/downloads/en/PackagingSpec/00049AW.pdf
SW0-SW18 SWcolor SWlcd = SW SPDT- APEM Série 523x: Switch unipolaire a levier
TR_5V = TRACO THN 20-4811Wi: Traco 20W 24V to 5V*4A
Ureg_3V = MCP1826S-3302E/DB: 1000 mA, Low Voltage, Low Quiescent Current LDO Regulator, 3-Pin SOT-223, Extended Temperature; FirstPublished: 29-Jan-2009; DatasheetVersion: revA, Aug-2007; PackageVersion: revBB, Aug-2009; PackageReference: SOT-223-DB3; Publisher: Altium Limited; PackageDescription: 3-Lead Plastic Small Outline Transistor (DB) [SOT-223]; Supplier 1: Digi-Key; Supplier Part Number 1: MCP1826S-3302E/DB-ND; Supplier 2: Farnell; Supplier Part Number 2: 1578424; Supplier 3: Newark; Supplier Part Number 3: 27M0037; ComponentLink1Description: Datasheet; ComponentLink1URL: http://ww1.microchip.com/downloads/en/DeviceDoc/22057a.pdf; ComponentLink2Description: Packaging Specification; ComponentLink2URL: http://www.microchip.com/stellent/groups/techpub_sg/documents/packagingspec/en012702.pdf; ComponentLink3Description: Microchip.com Home; ComponentLink3URL: http://www.microchip.com/
Y1 = Quartz: Crystal Oscillator; Published: 8-Jun-2000; LatestRevisionDate: 17-Jul-2002; LatestRevisionNote: Re-released for DXP Platform.; PackageReference: R38; Publisher: Altium Limited
rx STgnd tx = Goutte Strap_2: LatestRevisionDate: 30/01/11; Publisher: Damien Guitton